# Altium schematic sheet Sheet5.SchDoc
size A4
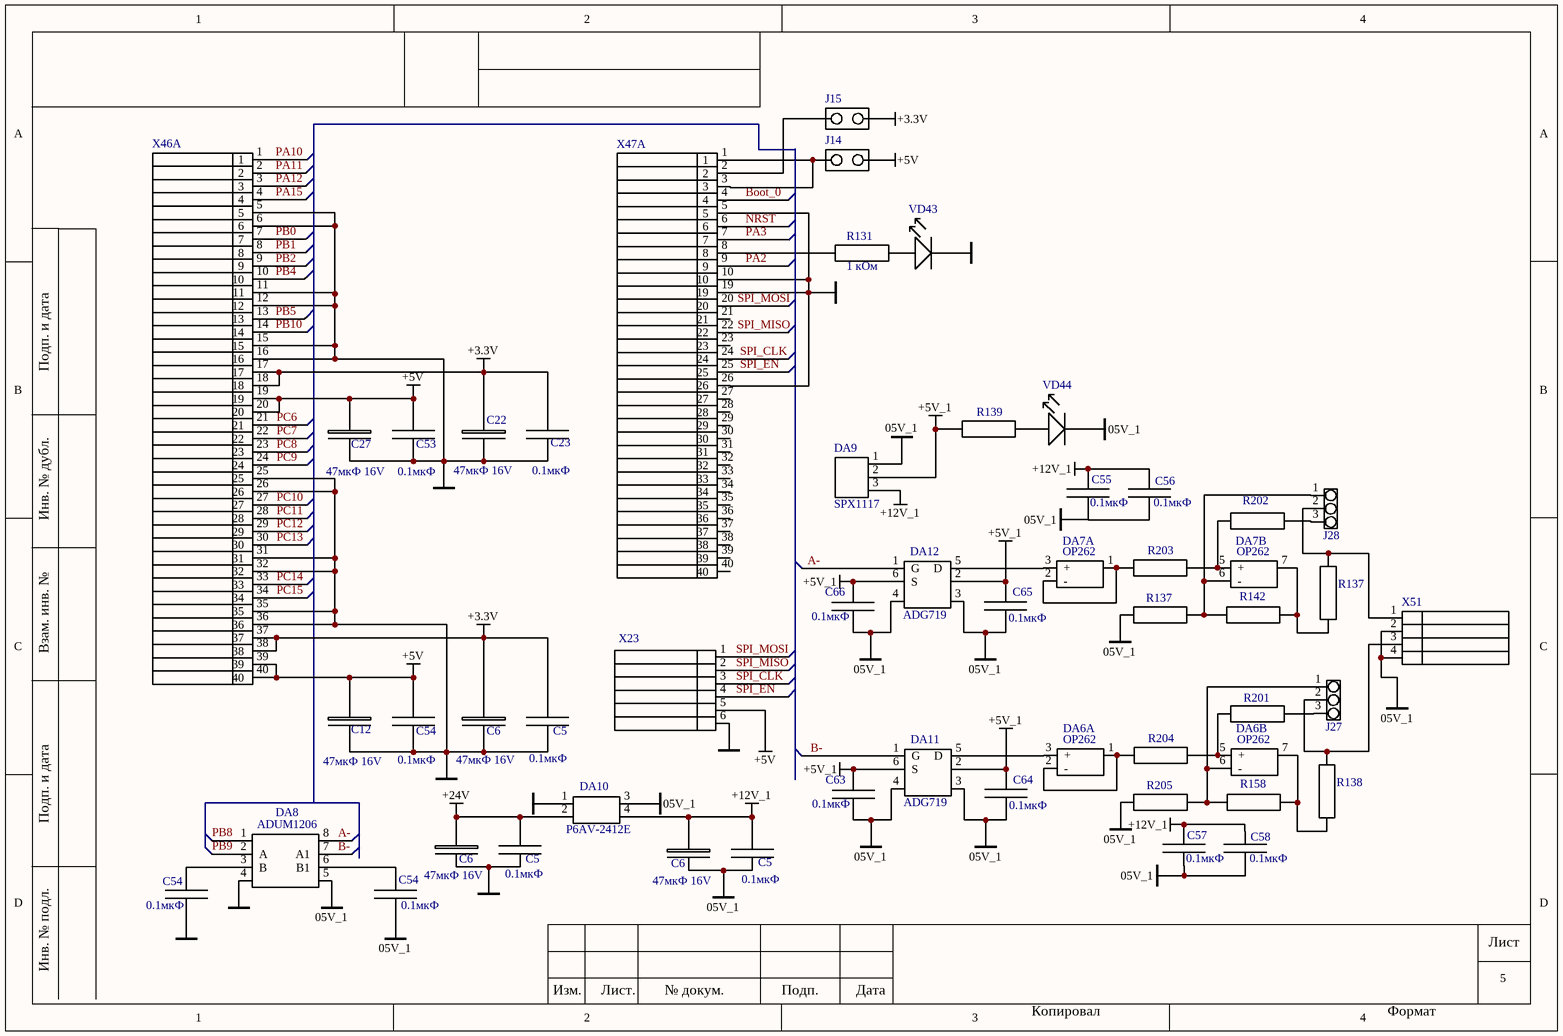
[diagram p0: Sheet5.SchDoc]

## Parts
(Parts that share a designator on the sheet are numbered #1, #2 ... from top to bottom, then left to right.)
C5#1  C0805  (value not drawn)
C5#2  C0805  (value not drawn)
C5#3  C0805  (value not drawn)
C6#1  C_e  (value not drawn)
C6#2  C_e  (value not drawn)
C6#3  C_e  (value not drawn)
C12  C_e  (value not drawn)
C22  C_e  (value not drawn)
C23  C0805  (value not drawn)
C27  C_e  (value not drawn)
C53  C0805  (value not drawn)
C54#1  C0805  (value not drawn)
C54#2  C0805  (value not drawn)
C54#3  C0805  (value not drawn)
C55  C0805  (value not drawn)
C56  C0805  (value not drawn)
C57  C0805  (value not drawn)
C58  C0805  (value not drawn)
C63  C0805  (value not drawn)
C64  C0805  (value not drawn)
C65  C0805  (value not drawn)
C66  C0805  (value not drawn)
DA6  OP262  (parts A,B of 2)
DA7  OP262  (parts A,B of 2)
DA8  ADUM1206
DA9  SPX1117
DA10  P6AV-2412E
DA11  ADG719
DA12  ADG719
J14  jamp  (value not drawn)
J15  jamp  (value not drawn)
J27  jamp3  (value not drawn)
J28  jamp3  (value not drawn)
R131  R0805  (value not drawn)
R137#1  R0805  (value not drawn)
R137#2  R0805  (value not drawn)
R138  R0805  (value not drawn)
R139  R0805  (value not drawn)
R142  R0805  (value not drawn)
R158  R0805  (value not drawn)
R201  R0805  (value not drawn)
R202  R0805  (value not drawn)
R203  R0805  (value not drawn)
R204  R0805  (value not drawn)
R205  R0805  (value not drawn)
VD43  LED  (value not drawn)
VD44  LED  (value not drawn)
X23  PLS-6  (value not drawn)
X46#1  PLD40  (value not drawn)  (parts A,B,C,D,E,F,G,H,I,J,K,L,M,N,O,P,Q,R,S,U,V,W,X,Y,Z,27,28,29,30,31,32,33,34,35,36,37,38,39,40,41 of 41)
X46#2  PLD40  (value not drawn)  (parts B,C,D,E,F,G,H,I,J,S,U,V,W,X,Y,Z,27,28,29,30,31,32,33,34,35,36,37,38,39,40,41 of 41)
X47  PLD40  (value not drawn)  (part A of 41)
X51  15e4  (value not drawn)

## Nets
05V_1: C5#3.2 C6#3.2 C54#3.1 C55.1 C56.1 C57.1 C58.1 C63.2 C64.2 C65.2 C66.2 DA6.4 DA7.4 DA8.5 DA9.1 DA10.3 DA11.3 DA11.4 DA12.3 DA12.4 R137#1.1 R205.1 VD44.1(A) X51.2 X51.4
+3.3V: C5#1.1 C6#1.1 C22.1 C23.1 J15.2 X46#1.17 X46#1.18 X46#1.37 X46#1.38
+5V: C12.1 C27.1 C53.1 C54#1.1 J14.2 X23.5 X46#1.19 X46#1.20 X46#1.39 X46#1.40
+5V_1: C63.1 C64.1 C65.1 C66.1 DA9.2 DA11.2 DA11.6(S) DA12.2 DA12.6(S) R139.1
+12V_1: C5#3.1 C6#3.1 C55.2 C56.2 C57.2 C58.2 DA6.8 DA7.8 DA9.3 DA10.4
+24V: C5#2.1 C6#2.1 DA10.2
GND: C5#1.2 C5#2.2 C6#1.2 C6#2.2 C12.2 C22.2 C23.2 C27.2 C53.2 C54#1.2 C54#2.1 DA8.4 DA10.1 VD43.1(A) X23.6 X46#1.5 X46#1.6 X46#1.11 X46#1.12 X46#1.15 X46#1.16 X46#1.25 X46#1.26 X46#1.31 X46#1.32 X46#1.35 X46#1.36 X46#2.5 X46#2.10 X46#2.19 X46#2.26
~{NRST}: X46#2.6
A-: DA8.8 DA12.1(G)
B-: DA8.7(A1) DA11.1(G)
Boot_0: X46#2.4
PA2: X46#2.9
PA3: X46#2.7
PA10: X46#1.1
PA11: X46#1.2
PA12: X46#1.3
PA15: X46#1.4
PB0: X46#1.7
PB1: X46#1.8
PB2: X46#1.9
PB4: X46#1.10
PB5: X46#1.13
PB8: DA8.1
PB9: DA8.2(A)
PB10: X46#1.14
PC6: X46#1.21
PC7: X46#1.22
PC8: X46#1.23
PC9: X46#1.24
PC10: X46#1.27
PC11: X46#1.28
PC12: X46#1.29
PC13: X46#1.30
PC14: X46#1.33
PC15: X46#1.34
SPI_CLK: X23.3 X46#2.24
SPI_EN: X23.4 X46#2.25
SPI_MISO: X23.2 X46#2.22
SPI_MOSI: X23.1 X46#2.20
NetC54#2_2: C54#2.2 DA8.3(B)
NetC54#3_2: C54#3.2 DA8.6(B1)
NetDA6_1: DA6.1(OUT) DA6.2(-) R204.1
NetDA6_3: DA6.3(+) DA11.5(D)
NetDA6_5: DA6.5(+) R201.1 R204.2
NetDA6_6: DA6.6(-) J27.1 R158.1 R205.2
NetDA6_7: DA6.7(OUT) R138.1 R158.2
NetDA7_1: DA7.1(OUT) DA7.2(-) R203.1
NetDA7_3: DA7.3(+) DA12.5(D)
NetDA7_5: DA7.5(+) R202.1 R203.2
NetDA7_6: DA7.6(-) J28.1 R137#1.2 R142.1
NetDA7_7: DA7.7(OUT) R137#2.1 R142.2
NetJ14_1: J14.1 X46#2.3 X47.1
NetJ15_1: J15.1 X46#2.2
NetJ27_2: J27.2 R138.2 X51.3
NetJ27_3: J27.3 R201.2
NetJ28_2: J28.2 R137#2.2 X51.1
NetJ28_3: J28.3 R202.2
NetR131_1: R131.1 X46#2.8
NetR131_2: R131.2 VD43.2(K)
NetR139_2: R139.2 VD44.2(K)

Not connected (* = marked no-connect by the designer): X46#2 21 23 27 28 29 30 31 32 33 34 35 36 37 38 39 40

## Notes on the sheet
- 5
- Подп. и дата
- Инв. № дубл.
- Взам. инв. №
- Инв. № подл.
- Лист
- Изм.
- Лист.
- № докум.
- Подп.
- Дата
- Копировал
- Формат
- (in symbol C0805) 0.1мкФ
- (in symbol C_e) 47мкФ 16V
- (in symbol R0805) 1 кОм